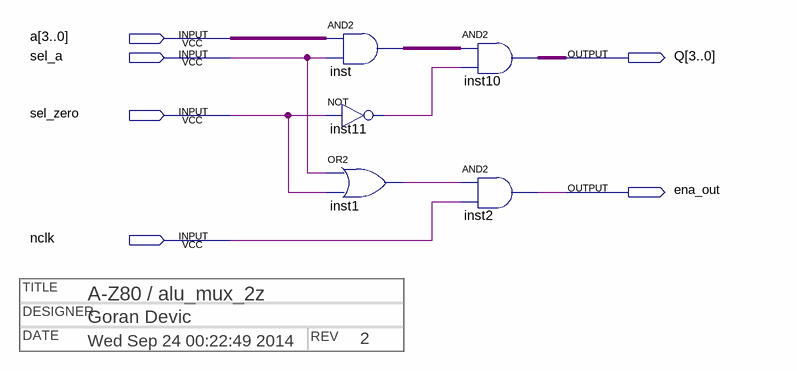
[diagram p0: schematic sheet]
// Quartus schematic alu_mux_2z.bdf as structural Verilog: 5 symbols, 6 pins
// Title block: TITLE: A-Z80 / alu_mux_2z; DESIGNER: Goran Devic; DATE: Wed Sep 24 00:22:49 2014; REV: 2
module alu_mux_2z (
  input  [3:0] a,
  input  sel_a,
  input  sel_zero,
  input  nclk,
  output [3:0] Q,
  output ena_out
);

  wire inst1_out, inst11_out;
  wire [3:0] inst_out;

  assign inst_out = a & {4{sel_a}};  // AND2 inst, 4 bits wide
  not inst11 (inst11_out, sel_zero);
  or inst1 (inst1_out, sel_a, sel_zero);
  assign Q = inst_out & {4{inst11_out}};  // AND2 inst10, 4 bits wide
  and inst2 (ena_out, inst1_out, nclk);
endmodule
